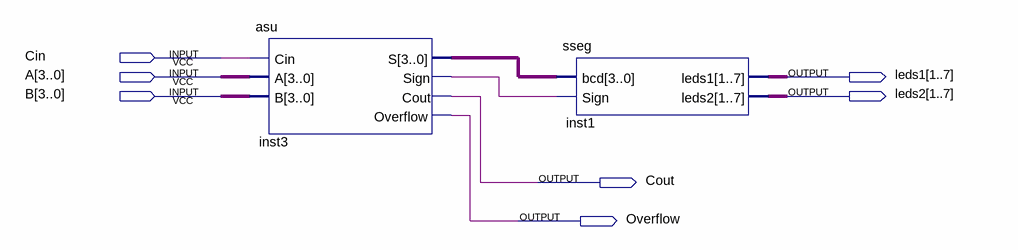
[diagram p0: schematic sheet]
// Quartus schematic PartA.bdf as structural Verilog: 2 symbols, 7 pins
module PartA (
  input  Cin,
  input  [3:0] A,
  input  [3:0] B,
  output [1:7] leds1,
  output [1:7] leds2,
  output Cout,
  output Overflow
);

  wire inst3_sign;
  wire [3:0] inst3_s;

  asu inst3 (.Cin(Cin), .A(A), .B(B), .S(inst3_s), .Sign(inst3_sign), .Cout(Cout), .Overflow(Overflow));
  sseg inst1 (.bcd(inst3_s), .Sign(inst3_sign), .leds1(leds1), .leds2(leds2));
endmodule
